# EAGLE design 2ndtry (EAGLE 5.06)
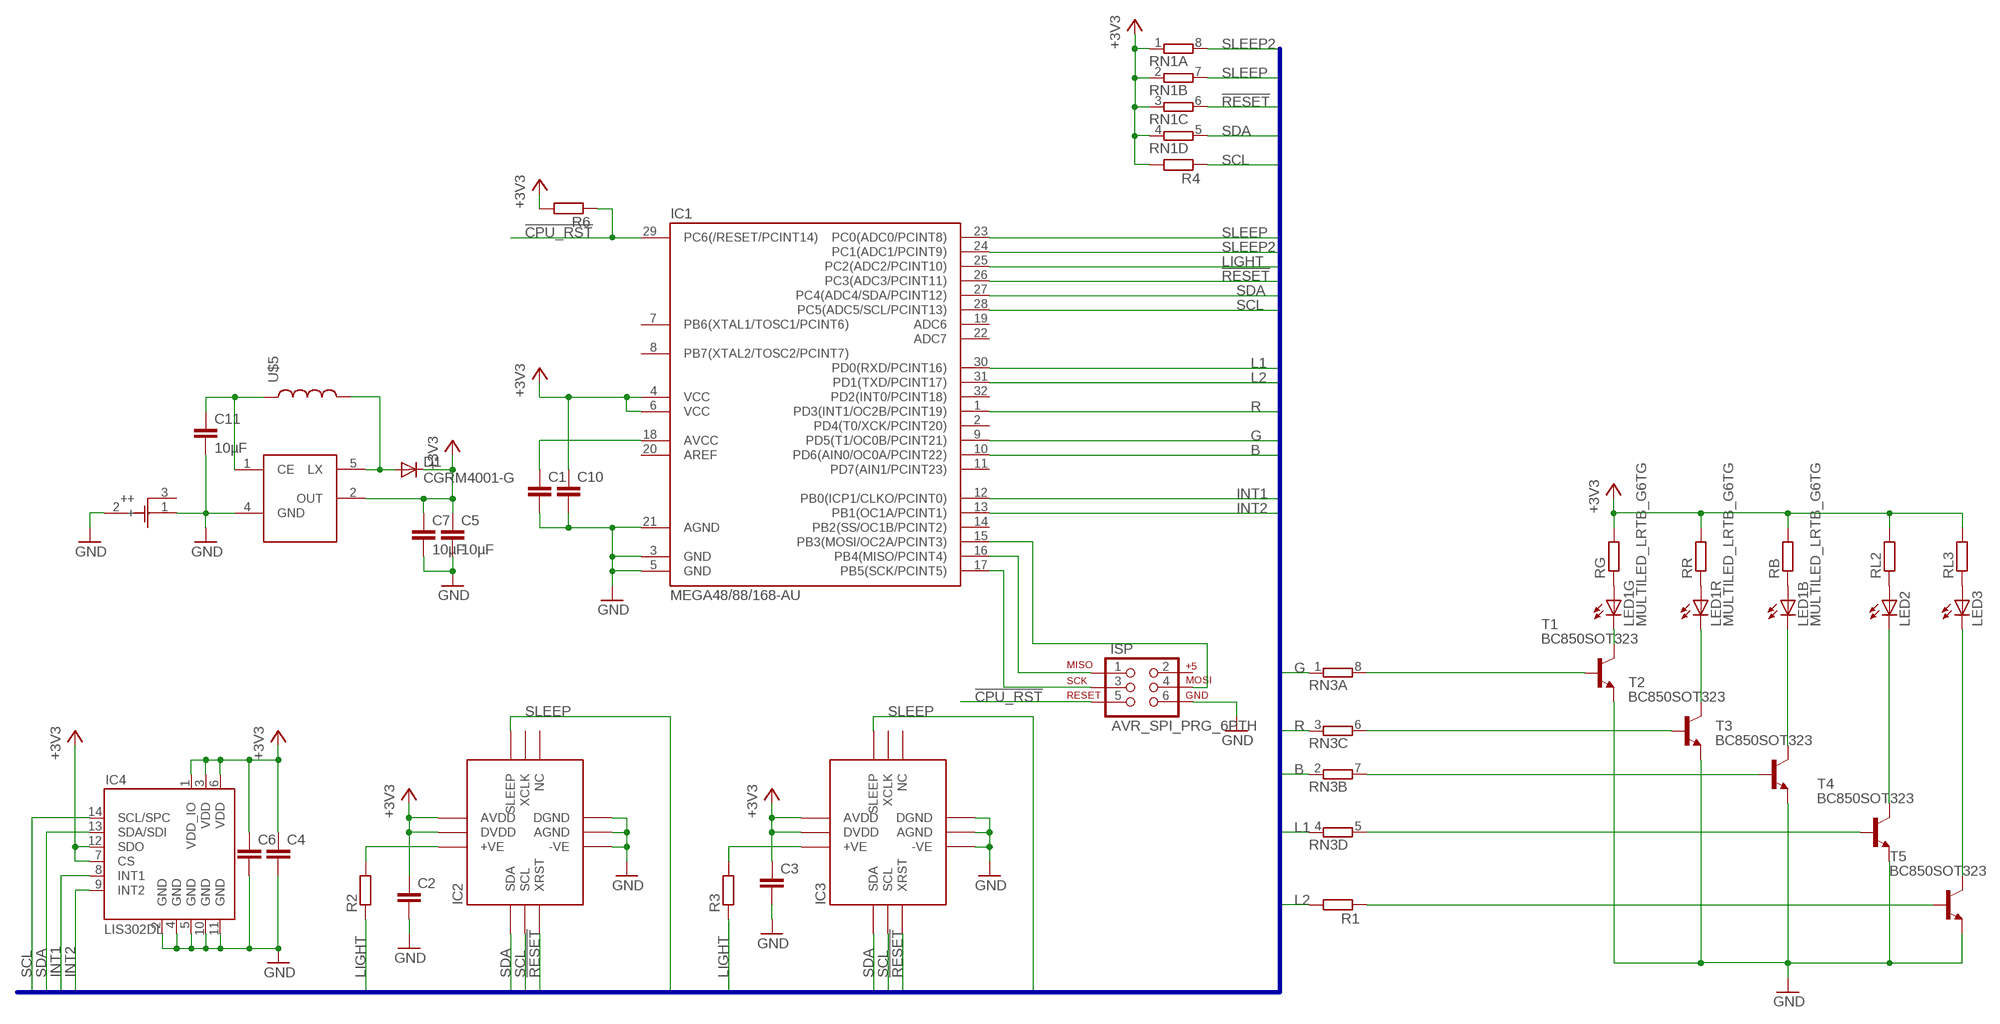
[diagram p0: schematic, sheet 1]

## Parts
C1  C-EUC0402  [C0402]
C2  C-EUC0402  [C0402]
C3  C-EUC0402  [C0402]
C4  C-EUC0402  [C0402]
C5  10µF  C-EUC0805  [C0805]
C6  C-EUC0805  [C0805]
C7  10µF  C-EUC0805  [C0805]
C10  C-EUC0402  [C0402]
C11  10µF  C-EUC0805  [C0805]
D1  CGRM4001-G  [SOD-123_MINI-SMA]
IC1  MEGA48/88/168-AU  [TQFP32-08]
IC2  ADJD_COLOR_SENSOR_SMD  [ADJD-S371]
IC3  ADJD_COLOR_SENSOR_SMD  [ADJD-S371]
IC4  LIS302DL  [LGA14]
ISP  AVR_SPI_PRG_6PTH  [2X3]
LED1  MULTILED_LRTB_G6TG  [P-LCC-6_TOPLED]
LED2  LEDCHIPLED_0603  [CHIPLED_0603]
LED3  LEDCHIPLED_0603  [CHIPLED_0603]
R1  R-EU_R0603  [R0603]
R2  R-EU_R0603  [R0603]
R3  R-EU_R0603  [R0603]
R4  R-EU_R0603  [R0603]
R6  R-EU_R0603  [R0603]
RB  R-EU_R0603  [R0603]
RG  R-EU_R0603  [R0603]
RL2  R-EU_R0603  [R0603]
RL3  R-EU_R0603  [R0603]
RN1  4R-NCAY16  [CAY16]
RN3  4R-NCAY16  [CAY16]
RR  R-EU_R0603  [R0603]
T1  BC850SOT323  [SOT323-BEC]
T2  BC850SOT323  [SOT323-BEC]
T3  BC850SOT323  [SOT323-BEC]
T4  BC850SOT323  [SOT323-BEC]
T5  BC850SOT323  [SOT323-BEC]
U$2  BATT  [BATTCOM_20MM_PTH]
U$4  NCP1402  [SOT23-5]
U$5  INDUCTORCDRH62B  [CDRH62BNP-470MC]

## Nets
!CPU_RST: IC1.29(PC6(/RESET/PCINT14)) ISP.5 R6.1
!RESET: IC1.26(PC3(ADC3/PCINT11)) IC2.10(XRST) IC3.10(XRST) RN1.6
+3V3: C2.1 C3.1 C4.1 C5.1 C6.1 C7.1 C10.1 D1.C IC1.4(VCC) IC1.6(VCC) IC2.5(DVDD) IC2.7(AVDD) IC3.5(DVDD) IC3.7(AVDD) IC4.1(VDD_IO) IC4.3(VDD) IC4.6(VDD) IC4.7(CS) IC4.12(SDO) R4.2 R6.2 RB.2 RG.2 RL2.2 RL3.2 RN1.1 RN1.2 RN1.3 RN1.4 RR.2 U$4.2(OUT)
B: IC1.10(PD6(AIN0/OC0A/PCINT22)) RN3.2
G: IC1.9(PD5(T1/OC0B/PCINT21)) RN3.1
GND: C1.2 C2.2 C3.2 C4.2 C5.2 C6.2 C7.2 C10.2 C11.2 IC1.3(GND) IC1.5(GND) IC1.21(AGND) IC2.1(-VE) IC2.9(AGND) IC2.11(DGND) IC3.1(-VE) IC3.9(AGND) IC3.11(DGND) IC4.2(GND) IC4.4(GND) IC4.5(GND) IC4.10(GND) IC4.11(GND) ISP.6 T1.E T2.E T3.E T4.E T5.E U$2.1(+) U$2.2(-) U$4.4(GND)
INT1: IC1.12(PB0(ICP1/CLKO/PCINT0)) IC4.8(INT1)
INT2: IC1.13(PB1(OC1A/PCINT1)) IC4.9(INT2)
L1: IC1.30(PD0(RXD/PCINT16)) RN3.4
L2: IC1.31(PD1(TXD/PCINT17)) R1.2
LIGHT: IC1.25(PC2(ADC2/PCINT10)) R2.1 R3.1
N$1: C1.1 IC1.18(AVCC)
N$3: RN3.7 T3.B
N$4: RN3.6 T2.B
N$5: IC1.17(PB5(SCK/PCINT5)) ISP.3
N$6: IC1.16(PB4(MISO/PCINT4)) ISP.1
N$10: LED1.C2(G:C) T1.C
N$11: LED1.C1(R:C) T2.C
N$12: LED1.C3(B:C) T3.C
N$13: IC2.3(+VE) R2.2
N$14: IC3.3(+VE) R3.2
N$15: IC1.15(PB3(MOSI/OC2A/PCINT3)) ISP.4
N$16: C11.1 U$4.1(CE) U$5.P$1
N$18: LED1.A2(G:A) RG.1
N$19: D1.A U$4.5(LX) U$5.P$2
N$22: RN3.8 T1.B
N$27: LED1.A1(R:A) RR.1
N$28: LED2.C T4.C
N$29: LED3.C T5.C
N$30: LED1.A3(B:A) RB.1
N$31: LED2.A RL2.1
N$32: LED3.A RL3.1
N$33: RN3.5 T4.B
N$34: R1.1 T5.B
R: IC1.1(PD3(INT1/OC2B/PCINT19)) RN3.3
SCL: IC1.28(PC5(ADC5/SCL/PCINT13)) IC2.6(SCL) IC3.6(SCL) IC4.14(SCL/SPC) R4.1
SDA: IC1.27(PC4(ADC4/SDA/PCINT12)) IC2.4(SDA) IC3.4(SDA) IC4.13(SDA/SDI) RN1.5
SLEEP: IC1.23(PC0(ADC0/PCINT8)) IC2.8(SLEEP) IC3.8(SLEEP) RN1.7
SLEEP2: IC1.24(PC1(ADC1/PCINT9)) RN1.8
Unconnected: IC1.2(PD4(T0/XCK/PCINT20)) IC1.7(PB6(XTAL1/TOSC1/PCINT6)) IC1.8(PB7(XTAL2/TOSC2/PCINT7)) IC1.11(PD7(AIN1/PCINT23)) IC1.14(PB2(SS/OC1B/PCINT2)) IC1.19(ADC6) IC1.20(AREF) IC1.22(ADC7) IC1.32(PD2(INT0/PCINT18)) IC2.2(NC) IC2.12(XCLK) IC3.2(NC) IC3.12(XCLK) ISP.2 U$2.3(++)

## Buses
COLOR:SDA,SCL,!RESET,LIGHT,SLEEP,INT1,INT2,R,G,B,L1,L2,PWR_SHN

## Library data of the parts
C1-C7 C10 C11 = rcl:C-EU: CAPACITOR, European symbol
D1 = diode:CGRM400*-G: Molded plasitc,JEDEC SOD-123/Mini SMA Source: Comchip CGRM4001-G.pdf
IC1 = avr-4:MEGA48/88/168
IC2 IC3 = SparkFun:ADJD_COLOR_SENSOR: Color Light Sensor ADJD-S371 from Avago. Digital RGB light sensor (I2C) with on-board white LED. Not quite proven footprint or schematic component. SKU: COM-08618
IC4 = SparkFunB:LIS302DL
ISP = SparkFun:AVR_SPI_PRG_6: AVR ISP 6 Pin This is the reduced ISP connector for AVR programming. Common on Arduino. This footprint will take up less PCB space and can be used with a 10-pin to 6-pin adapter such as SKU: BOB-08508
LED1 = led:MULTILED_LRTB_G6TG: 6-lead MULTILED® Enhanced optical Power LED (ThinFilm® / ThinGaN®) Source. OSRAM - LRTB_G6TG.pdf
LED2 LED3 = led:LED: LED OSRAM: - CHIPLED LG R971, LG N971, LY N971, LG Q971, LY Q971, LO R971, LY R971 LH N974, LH R974 LS Q976, LO Q976, LY Q976 LO Q996 - Hyper CHIPLED LW Q18S LB Q993, LB Q99A, LB R99A - SideLED LS A670, LO A670, LY A670, LG A670, LP A670 LB A673, LV A673, LT A673, LW A673 LH A674 LY A675 LS A676, LA A676, LO A676, LY A676, LW A676 LS A679, LY A679, LG A679 - Hyper Micro SIDELED® LS Y876, LA Y876, LO Y876, LY Y876 LT Y87S - SmartLED LW L88C, LW L88S LB L89C, LB L89S, LG L890 LS L89K, LO L89K, LY L89K LS L896, LA L896, LO L896, LY L896 - TOPLED LS T670, LO T670, LY T670, LG T670, LP T670 LSG T670, LSP T670, LSY T670, LOP T670, LYG T670 LG T671, LOG T671, LSG T671 LB T673, LV T673, LT T673, LW T673 LH T674 LS T676, LA T676, LO T676, LY T676, LB T676, LH T676, LSB T676, LW T676 LB T67C, LV T67C, LT T67C, LS T67K, LO T67K, LY T67K, LW E67C LS E67B, LA E67B, LO E67B, LY E67B, LB E67C, LV E67C, LT E67C LW T67C LS T679, LY T679, LG T679 LS T770, LO T770, LY T770, LG T770, LP T770 LB T773, LV T773, LT T773, LW T773 LH T774 LS E675, LA E675, LY E675, LS T675 LS T776, LA T776, LO T776, LY T776, LB T776 LHGB T686 LT T68C, LB T68C - Hyper Mini TOPLED® LB M676 - Mini TOPLED Santana® LG M470 LS M47K, LO M47K, LY M47K Source: http://www.osram.convergy.de LUXEON: - LUMILED® LXK2-PW12-R00, LXK2-PW12-S00, LXK2-PW14-U00, LXK2-PW14-V00 LXK2-PM12-R00, LXK2-PM12-S00, LXK2-PM14-U00 LXK2-PE12-Q00, LXK2-PE12-R00, LXK2-PE12-S00, LXK2-PE14-T00, LXK2-PE14-U00 LXK2-PB12-K00, LXK2-PB12-L00, LXK2-PB12-M00, LXK2-PB14-N00, LXK2-PB14-P00, LXK2-PB14-Q00 LXK2-PR12-L00, LXK2-PR12-M00, LXK2-PR14-Q00, LXK2-PR14-R00 LXK2-PD12-Q00, LXK2-PD12-R00, LXK2-PD12-S00 LXK2-PH12-R00, LXK2-PH12-S00 LXK2-PL12-P00, LXK2-PL12-Q00, LXK2-PL12-R00 Source: www.luxeon.com KINGBRIGHT: KA-3528ASYC Source: www.kingbright.com
R1-R4 R6 RB RG RL2 RL3 RR = rcl:R-EU_: RESISTOR, European symbol
RN1 RN3 = resistor-dil:4R-N: Array Chip Resistor Source: RS Component / Phycomp
T1-T5 = additional:BC850: NPN TRANSISTOR
U$2 = additional:BATT
U$4 = additional:NCP1402
U$5 = additional:INDUCTOR: Inductors Basic Inductor/Choke - 0603 and 1206. Footprints are not proven and vary greatly between part numbers.

## Board
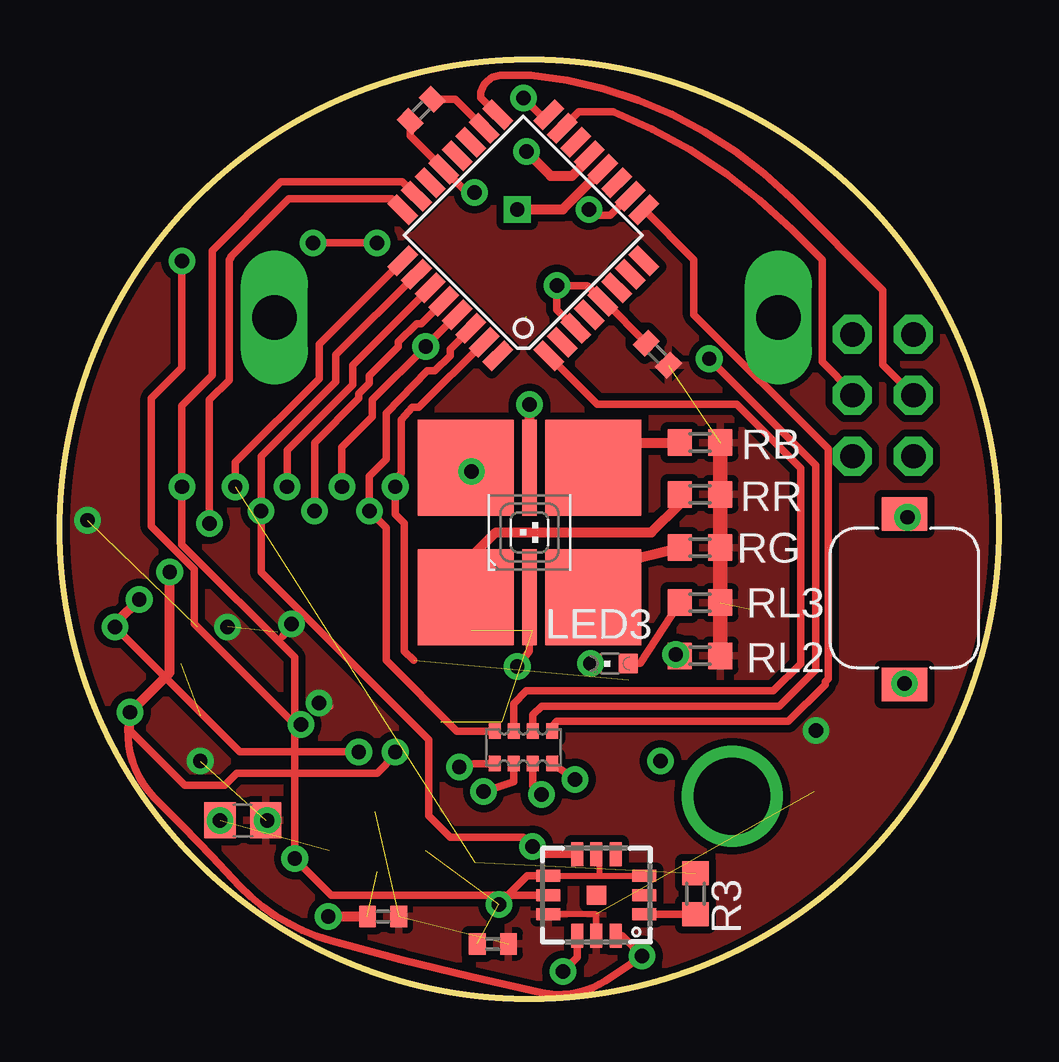
[diagram p1: board, top side]
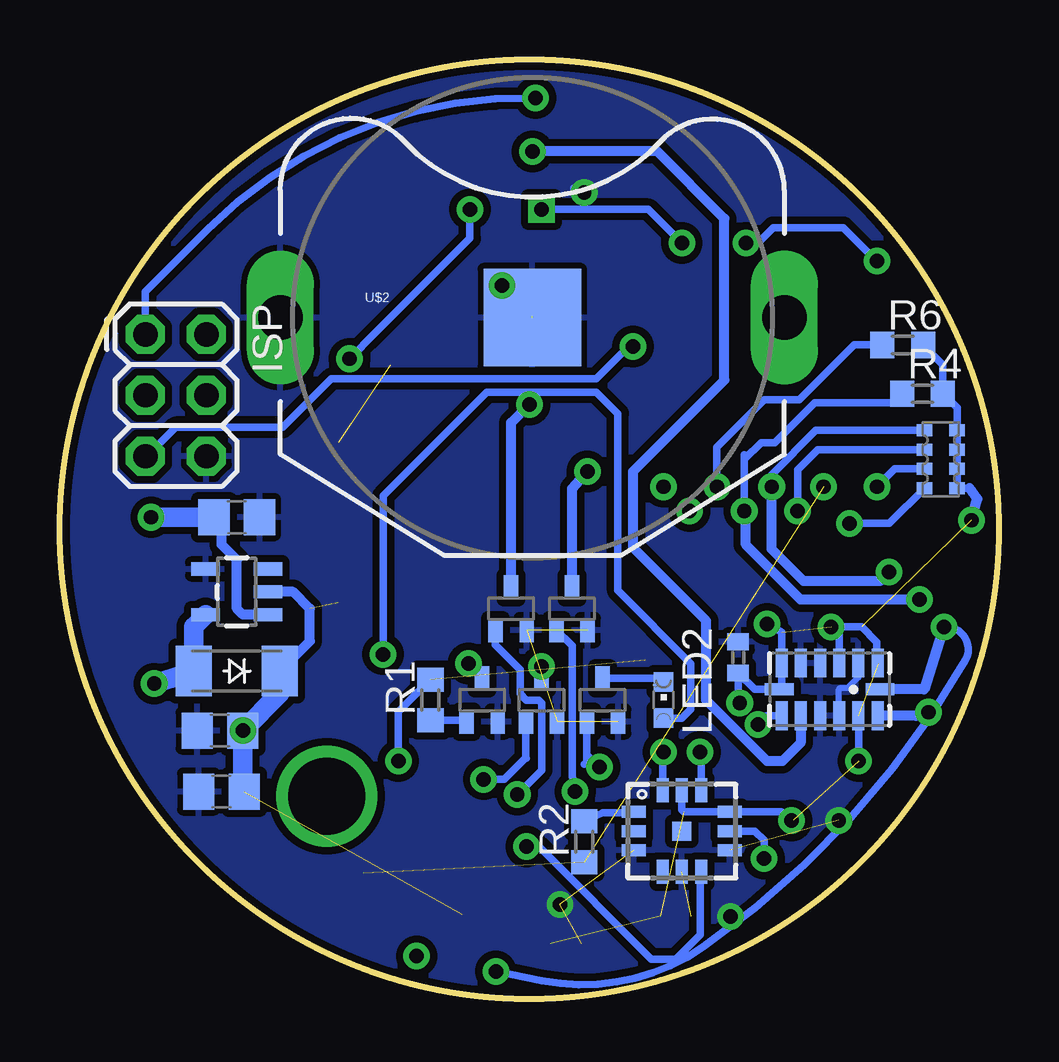
[diagram p2: board, bottom side, seen from below]

Size 39.12 x 39.12 mm. Coordinates in mm from the lower left corner, seen from the top.
Outline: circle at 19.56,19.56 radius 19.56
Copper layers (1*16): Top 0.035mm / dielectric 1.5mm / Bottom 0.035mm
Design rules "SparkFun *": minimum track width 8mil, minimum drill 20mil, track to track 8mil, track to pad 8mil, pad to pad 8mil, via to via 8mil, smd to smd 0mil, copper to edge 10mil, drill to drill 8mil, minimum pad ring 12mil, minimum via ring 10mil, stop-mask expansion 4mil, vias tented up to drill 25mil, thermal gap 10mil

### Footprints (pad centres in the part's own frame; a part is rotated, then mirrored left to right if it is on the bottom)
C0402 = smd 0.7 x 0.9: 1 -0.65,0; 2 0.65,0
C0805 = smd 1.3 x 1.5: 1 -0.95,0; 2 0.95,0
SOD-123_MINI-SMA = smd 1.5 x 2.1: A 1.8,0; C -1.8,0
TQFP32-08 = smd 1.27 x 0.559: 1 -4.293,2.8; 2 -4.293,2; 3 -4.293,1.2; 4 -4.293,0.4; 5 -4.293,-0.4; 6 -4.293,-1.2; 7 -4.293,-2; 8 -4.293,-2.8; 17 4.293,-2.8; 18 4.293,-2; 19 4.293,-1.2; 20 4.293,-0.4; 21 4.293,0.4; 22 4.293,1.2; 23 4.293,2; 24 4.293,2.8 | smd 0.559 x 1.27: 9 -2.8,-4.293; 10 -2,-4.293; 11 -1.2,-4.293; 12 -0.4,-4.293; 13 0.4,-4.293; 14 1.2,-4.293; 15 2,-4.293; 16 2.8,-4.293; 25 2.8,4.293; 26 2,4.293; 27 1.2,4.293; 28 0.4,4.293; 29 -0.4,4.293; 30 -1.2,4.293; 31 -2,4.293; 32 -2.8,4.293
ADJD-S371 = smd 1 x 0.5: 1 2,0.8; 2 2,0; 3 2,-0.8; 7 -2,-0.8; 8 -2,0; 9 -2,0.8 | smd 0.5 x 1: 4 0.8,-1.7; 5 0,-1.7; 6 -0.8,-1.7; 10 -0.8,1.7; 11 0,1.7; 12 0.8,1.7 | smd 0.8 x 0.8: PAD 0,0
LGA14 = smd 0.5 x 1.2: 1 2,1.1; 2 1.2,1.1; 3 0.4,1.1; 4 -0.4,1.1; 5 -1.2,1.1; 6 -2,1.1; 8 -2,-1.1; 9 -1.2,-1.1; 10 -0.4,-1.1; 11 0.4,-1.1; 12 1.2,-1.1; 13 2,-1.1 | smd 1.2 x 0.5: 7 -2.1,0; 14 2.1,0
2X3 = drill 1.016 octagon: 1 0,0; 2 0,2.54; 3 2.54,0; 4 2.54,2.54; 5 5.08,0; 6 5.08,2.54
P-LCC-6_TOPLED = smd 4 x 4: A1 -2.65,-2.7; A2 2.65,-2.7; A3 2.65,2.7; C1 -2.65,2.7 | smd 0.6 x 4: C2 0,-2.7; C3 0,2.7
CHIPLED_0603 = smd 0.8 x 0.8: A 0,-0.75; C 0,0.75
R0603 = smd 1 x 1.1: 1 -0.85,0; 2 0.85,0
CAY16 = smd 0.5 x 0.65: 1 -1.2,-0.675; 2 -0.4,-0.675; 3 0.4,-0.675; 4 1.2,-0.675; 5 1.2,0.675; 6 0.4,0.675; 7 -0.4,0.675; 8 -1.2,0.675
SOT323-BEC = smd 0.6 x 1: B -0.65,-0.9; C 0,0.9; E 0.65,-0.9
BATTCOM_20MM_PTH = drill 1.854 long: 1 -10.5,0; 3 10.5,0 | smd 4.064 x 4.064: 2 0,0
SOT23-5 = smd 0.55 x 1.2: 1 -0.95,-1.3; 2 0,-1.3; 3 0.95,-1.3; 4 0.95,1.3; 5 -0.95,1.3
CDRH62BNP-470MC = smd 1.9 x 1.4: P$1 0,-3.5; P$2 0,3.6

### Placement (x,y rotation side)
C1  15.05,37.02 225 top
C2  13.46,3.43 180 top
C3  18.03,2.29 180 top
C4  10.86,14.22 90 bottom
C5  32.45,11.18 180 bottom
C6  7.62,7.43 180 top
C7  32.39,8.64 180 bottom
C10  24.89,26.86 135 top
C11  31.75,20.07 0 bottom
D1  31.75,13.65 180 bottom
IC1  19.3,31.81 135 top
IC2  13.21,6.99 180 bottom
IC3  22.35,4.32 0 top
IC4  7.05,12.89 0 bottom
ISP  35.56,27.69 270 bottom
LED1  19.56,19.43 0 top
LED2  13.97,12.45 0 bottom
LED3  22.92,13.97 90 top
R1  23.69,12.45 90 bottom
R2  17.27,6.54 90 bottom
R3  26.48,4.38 270 top
R4  3.18,25.21 0 bottom
R6  4,27.24 0 bottom
RB  26.67,23.18 0 top
RG  26.67,18.8 0 top
RL2  26.67,14.29 0 top
RL3  26.67,16.51 0 top
RN1  2.41,22.48 90 bottom
RN3  19.3,10.48 180 top
RR  26.67,21.02 0 top
T1  19.05,12.45 0 bottom
T2  17.78,16.26 0 bottom
T3  20.32,16.26 0 bottom
T4  16.51,12.45 0 bottom
T5  21.53,12.45 0 bottom
U$2  19.43,28.38 0 bottom
U$4  31.75,16.95 90 bottom
U$5  35.18,16.7 180 top

### Tracks (layer width: path | path; a pad name or v marks a point on that pad's centre or on a via)
!CPU_RST  (via drill 0.6)
  Top 0.305: IC1.29 15.55,27.5 v15.24,27.18 13.02,24.96 13.02,24.26 11.75,22.99 v11.75,21.34
  Bottom 0.305: ISP.5 35.5,22.61 34.29,23.81 29.85,23.81 27.81,25.85 16.76,25.85 15.43,27.18 v15.24,27.18 | v11.75,21.34 11.75,22.99 9.78,24.96 8.32,24.96 6.03,27.24 R6.1
!RESET  (via drill 0.6)
  Top 0.305: IC1.26 11.49,26.83 11.49,25.72 8.38,22.61 v8.38,20.32 8.38,17.78 15.37,10.8 15.37,7.62 16.26,6.73 19.3,6.73 v19.69,6.35 20.02,6.02 IC3.10
  Bottom 0.305: RN1.6 7.54,22.88 8.38,22.03 v8.38,20.32 | v19.69,6.35 19.18,6.35 14.48,1.65 13.46,1.65 12.45,2.67 12.45,5.25 IC2.10
+3V3  (via drill 0.6)  (9 unrouted)
  Top 0.254: IC3.7 22.35,3.52 IC3.5
  Top 0.305: v10.8,12.32 11.11,12.32 11.24,12.19 | v8.64,7.43 8.64,7.37 | v6.99,15.49 6.6,15.49 | v9.65,15.62 9.27,15.11
  Top 0.406: C5.1 31.62,11.18 | v1.14,19.94 0.89,19.69
  Top 0.61: RL2.2 RL3.2 RG.2 RR.2 RB.2
  Bottom 0.305: v10.8,12.32 10.86,12.38 C4.1 10.18,12.89 IC4.7 9.05,12.99 IC4.6 9.05,15.27 v9.65,15.62 | 6.67,15.49 5.72,15.49 5.08,14.86 5.08,14.02 IC4.1 5.03,13.97 | IC4.3 6.65,15.48 6.67,15.49 | v5.84,9.91 IC4.12 | IC2.5 13.21,7.87 13.12,7.79 IC2.7 9.06,7.79 v8.64,7.43 | R6.2 2.33,26.42 R4.2 1.74,24.62 RN1.4 RN1.3 RN1.2 RN1.1 1.21,21.28 | 6.67,15.49 v6.99,15.49
  Bottom 0.406: U$4.2 29.4,16.96 28.7,16.26 28.7,14.9 D1.C | C5.1 | 1.21,21.28 0.89,20.83 v1.14,19.94
  Bottom 0.813: D1.C 29.95,12.73 C5.1 31.5,8.7 C7.1
  other vias: 31.5,11.18
  pour Top (isolate 0.305): 0.06,39.18 39.37,39.18 39.37,-0.19 0,-0.25
B  (via drill 0.6)
  Top 0.305: IC1.10 23.72,33.44 22.92,32.64 22.29,32.64 v22.04,32.89 | RN3.2 19.7,11.83 20.07,12.19 29.97,12.19 31.5,13.72 31.5,22.23 v27.05,26.67
  Bottom 0.305: v22.04,32.89 22.04,31.69 25.97,27.75 | 25.97,27.75 26.23,27.5 | v27.05,26.67 25.97,27.75
G
  Top 0.305: IC1.9 24.35,32.87 26.42,30.8 26.42,28.51 32,22.92 32,13.34 31.88,13.21 31.88,13.08 30.35,11.56 20.7,11.56 20.5,11.36 RN3.1
GND  (via drill 0.6)  (8 unrouted)
  Top 0.254: IC3.9 22.48,5.12 | 22.48,5.12 IC3.1 | IC3.11 22.48,6.02 22.48,5.12 | C6.2
  Top 0.305: C10.2 22.69,29.06 IC1.5 21.97,29.72 v20.7,29.72 20.7,28.72 IC1.3 | C1.2 14.59,35.96 IC1.21 16.96,33.59 v17.27,33.59 | IC3.9 19.47,5.12 v18.29,3.94
  Top 0.406: v11.18,3.43 C2.2
  Bottom 0.254: IC4.2 5.85,13.39 6.29,12.95 6.6,12.95 6.67,12.89 6.67,11.81 IC4.11
  Bottom 0.305: 19.43,28.45 v20.7,29.72 | v17.27,33.59 17.46,33.78 17.72,33.78
  other vias: 6.67,7.43
  pour Bottom (isolate 0.305): -1.4,40.39 40.64,40.39 40.64,-1.52 -1.4,-1.52
INT1  (via drill 0.6)
  Top 0.305: v10.54,31.5 v13.21,31.5 | v5.08,30.73 5.08,26.29 3.81,25.02 3.81,19.69 5.59,17.91 5.59,15.62 9.78,11.43 v10.03,11.43
  Top 0.406: IC1.12 20.96,32.89 v19.05,32.89
  Bottom 0.305: v19.05,32.89 14.61,32.89 v13.21,31.5 | v10.54,31.5 10.03,31.5 9.4,32.13 6.48,32.13 v5.08,30.73 | IC4.8 9.67,11.79 v10.03,11.43
INT2  (via drill 0.6)
  Top 0.406: IC1.13 22.06,35.01 21.34,34.29 20.45,34.29 v19.43,35.31
  Bottom 0.406: v19.43,35.31 14.22,35.31 11.43,32.51 11.43,25.78 15.24,21.97 15.24,18.8 12.19,15.75 12.19,12.45 9.65,9.91 9.02,9.91 8.26,10.67 IC4.9
L1  (via drill 0.6)
  Top 0.305: IC1.30 16.26,27.07 16.26,26.8 15.62,26.16 15.3,26.16 13.59,24.4 13.59,22.48 12.89,21.78 v12.89,20.32 13.59,19.62 13.59,14.1 16.53,11.15 RN3.4
L2  (via drill 0.6)  (1 unrouted)
  Top 0.305: IC1.31 14.96,24.64 14.67,24.64 14.22,24.13 14.22,21.91 13.97,21.65 v13.97,21.34 13.97,20.19 14.35,19.81 14.35,14.48 14.73,14.1
  Bottom 0.305: v25.02,9.91 25.02,11.96 R1.2
LIGHT  (via drill 0.6)  (2 unrouted)
  Top 0.305: IC1.25 10.8,27.26 10.8,25.85 7.3,22.35 v7.3,21.34
N$1
  Top 0.305: IC1.18 16.47,37.48 C1.1
N$2  (via drill 3.2)
  other vias: 28,8.45
N$3  (via drill 0.6)
  Top 0.305: RN3.7 19.7,8.87 v20.07,8.51
  Bottom 0.305: T3.B 20.98,15.37 20.98,14.76 19.94,13.72 19.94,12.7 19.69,12.45 19.18,12.45 19.05,12.32 19.05,9.53 v20.07,8.51
N$4  (via drill 0.6)
  Top 0.305: RN3.6 18.9,9.04 v17.65,8.64
  Bottom 0.305: v17.65,8.64 17.78,9.27 17.78,14.71 T2.B
N$5
  Top 0.305: ISP.3 34.29,26.42 34.29,29.53 30.48,33.34 arc39 19.62,38.48 18.42,38.48 arc90 17.53,37.59 17.53,37.55 IC1.17
N$6  (via drill 0.6)
  Top 0.305: IC1.16 20,36.83 v19.3,37.53
  Bottom 0.305: ISP.1 35.56,29.46 32.96,32.07 arc46 v19.3,37.53
N$10  (via drill 0.6)
  Top 0.305: v19.05,13.84 19.56,14.48 LED1.C2
  Bottom 0.305: T1.C v19.05,13.84
N$11  (via drill 0.6)
  Top 0.406: v17.15,21.97 17.26,21.78 LED1.C1
  Bottom 0.406: T2.C 17.78,21.27 v17.15,21.97
N$12  (via drill 0.6)
  Top 0.406: v19.56,24.77 LED1.C3
  Bottom 0.406: T3.C 20.32,24 v19.56,24.77
N$13
  Bottom 0.305: R2.2 16.51,7.75 15.25,7.75 IC2.3
N$14
  Top 0.305: IC3.3 26.47,3.52 R3.2
N$15
  Top 0.305: ISP.4 33.02,25.27 31.75,26.54 31.75,30.8 30.48,32.07 arc23 23.05,36.96 21.62,36.96 IC1.15
N$16  (via drill 0.6)
  Top 0.813: v35.32,20.07 U$5.P$1
  Bottom 0.406: U$4.1 31.5,16.01 31.75,16.26 31.75,18.29 32.39,18.92 32.39,19.75 C11.1
  Bottom 0.813: C11.1 v35.32,20.07
N$18
  Top 0.406: RG.1 23.26,18.16 LED1.A2
N$19  (via drill 0.6)
  Top 0.813: v35.19,13.13 U$5.P$2
  Bottom 0.813: v35.19,13.13 D1.A 33.55,15.51 U$4.5
N$22  (via drill 0.6)
  Top 0.305: RN3.8 21.44,9.17 v21.46,9.14
  Bottom 0.305: 19.7,10.05 T1.B | 19.7,10.05 19.69,10.03 | v21.46,9.14 20.6,9.14 19.7,10.05
N$27
  Top 0.406: RR.1 25.82,20.61 24.64,19.43 18.16,19.43 17.02,18.29 17.02,16.84 LED1.A1
N$28
  Bottom 0.305: T4.C 14.12,13.35 LED2.C
N$29  (via drill 0.6)
  Top 0.305: v22.1,13.97 LED3.C
  Bottom 0.305: v22.1,13.97 21.64,13.46 T5.C
N$30
  Top 0.406: RB.1 22.87,23.18 LED1.A3
N$31  (via drill 0.6)
  Top 0.305: RL2.1 25.72,14.29 v25.65,14.35
  Bottom 0.305: v25.65,14.35 25.65,20.96 21.34,25.27 16.76,25.27 15.88,24.38 15.88,17.02 12.83,13.97 12.83,12.07 13.21,11.68 13.96,11.68 LED2.A
N$32
  Top 0.305: LED3.A 24.18,13.98 RL3.1
N$33  (via drill 0.6)
  Top 0.305: RN3.5 17.25,9.8 v16.64,9.65
  Bottom 0.305: 17.16,10.16 17.16,9.89 17.27,9.78 | 17.16,10.16 T4.B | v16.64,9.65 16.65,9.65 17.16,10.16
N$34
  Bottom 0.305: R1.1 22.23,11.6 T5.B
R
  Top 0.305: RN3.3 18.9,12.3 19.43,12.83 29.72,12.83 30.86,13.97 30.86,22.1 28.19,24.77 22.39,24.77 IC1.1
SCL  (via drill 0.6)
  Top 0.305: IC1.28 15.06,28.13 14.86,28.13 14.1,27.37 14.1,27.18 12.89,25.97 12.89,25.65 12.45,25.21 12.45,25.02 10.6,23.18 v10.6,20.32 | v12.45,10.29 7.49,10.29 v2.29,15.49 | IC3.6 21.55,1.74 v20.96,1.14
  Top 0.406: v2.29,15.49 2.41,15.75 v3.3,16.64
  Bottom 0.305: v10.6,20.32 10.6,22.48 | 10.6,22.48 10.6,22.67 | 10.6,22.48 9.91,23.18 9.34,23.18 7.68,24.84 4.4,24.84 R4.1 | IC2.6 12.41,10.25 v12.45,10.29 | v20.96,1.14 19.05,0.76 arc-46 12.32,2.16 arc-26 1.4,14.1 arc-124 v2.29,15.49
  Bottom 0.406: IC4.14 3.11,12.89 v2.29,15.49 | v3.3,16.64 8.26,16.64 10.54,18.92 10.54,20.26 v10.6,20.32
SDA  (via drill 0.6)
  Top 0.305: IC1.27 12.19,26.4 12.19,25.59 9.46,22.86 v9.46,21.34 | v13.97,10.29 13.97,10.16 13.21,9.4 7.37,9.4 6.86,8.89 5.21,8.89 2.92,11.18 v2.92,11.94 arc57 3.94,8.38 arc-1 7.49,4.7 arc31 11.3,2.41 arc3 20.07,0.25 arc46 22.73,0.76 v24.26,1.78 23.42,2.62 IC3.4
  Top 0.406: v4.57,17.78 4.57,13.59 v2.92,11.94
  Bottom 0.305: RN1.5 7.63,23.68 9.46,21.84 v9.46,21.34 | IC2.4 14.01,10.25 v13.97,10.29
  Bottom 0.406: IC4.13 3.45,11.79 3.3,11.94 v2.92,11.94 | v9.46,21.34 9.46,18.73 8.13,17.4 4.95,17.4 v4.57,17.78
SLEEP  (via drill 0.6)
  Top 0.305: IC1.23 14.25,34.04 9.21,34.04 6.35,31.18 6.35,25.97 5.08,24.7 v5.08,21.34 5.08,18.92 9.78,14.22 v9.78,5.84 11.3,4.32 IC3.8
  Bottom 0.305: RN1.7 4.34,22.08 v5.08,21.34 | IC2.8 10.16,6.99 9.78,6.6 v9.78,5.84
SLEEP2  (via drill 0.6)
  Top 0.305: IC1.24 13.82,33.34 9.53,33.34 7.11,30.92 7.11,30.86 7.05,30.8 7.05,25.78 6.22,24.96 v6.22,19.81
  Bottom 0.305: RN1.8 4.56,19.81 v6.22,19.81